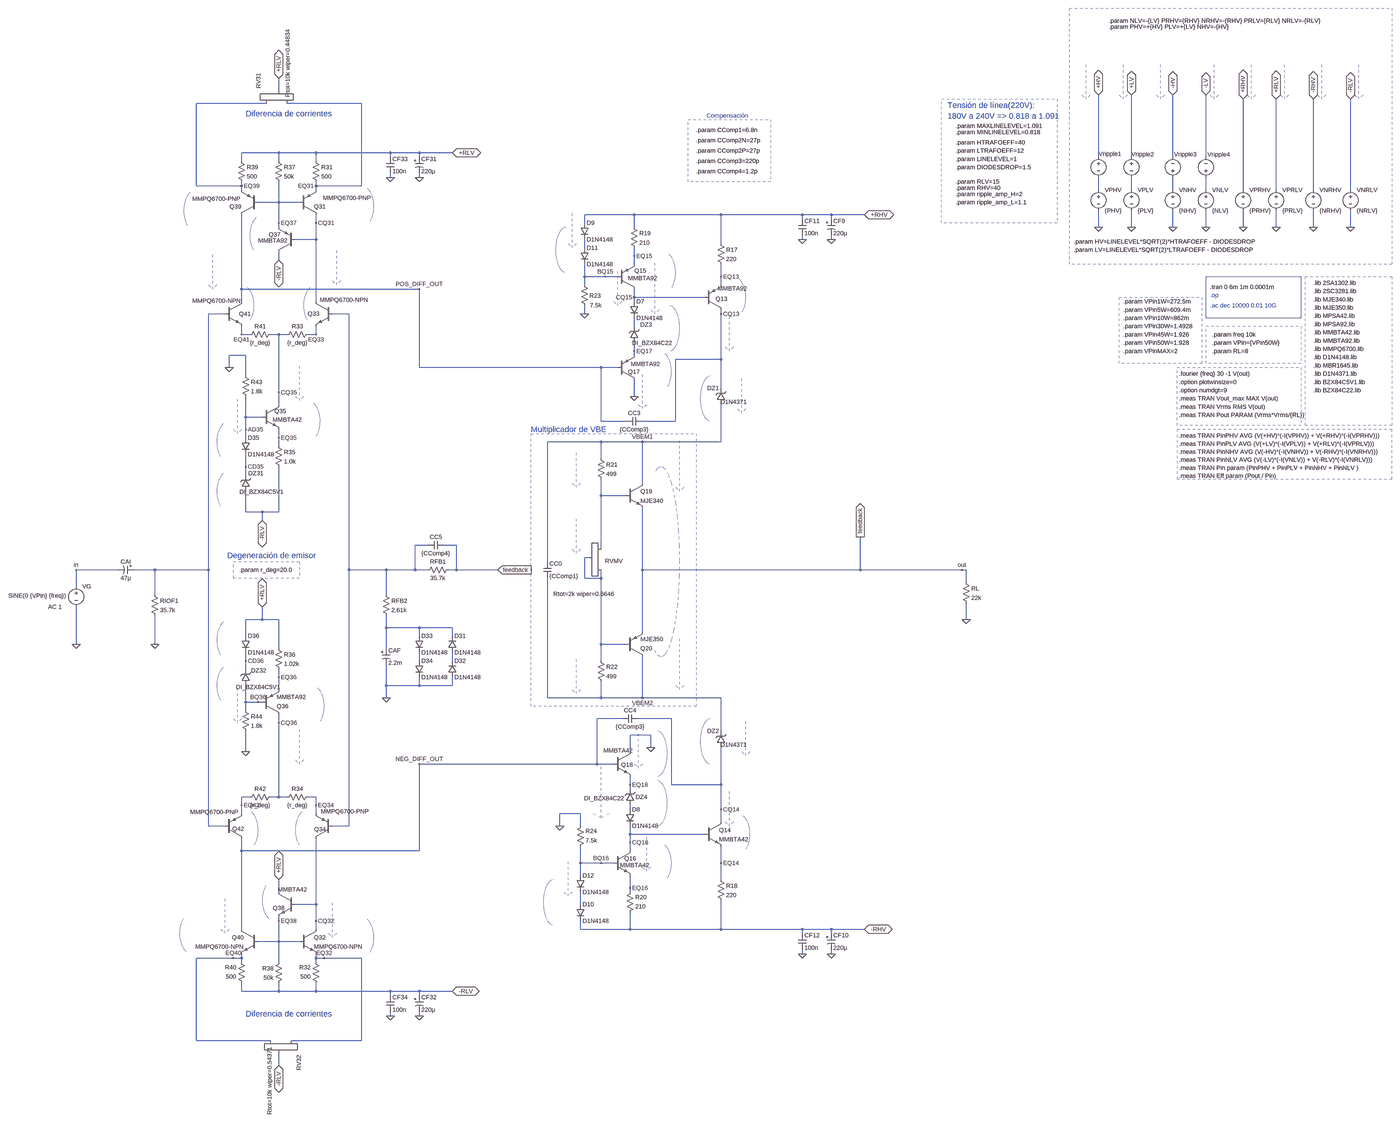
[diagram p0: schematic amplifier_V0.6_SMD_Test.asc, whole sheet]
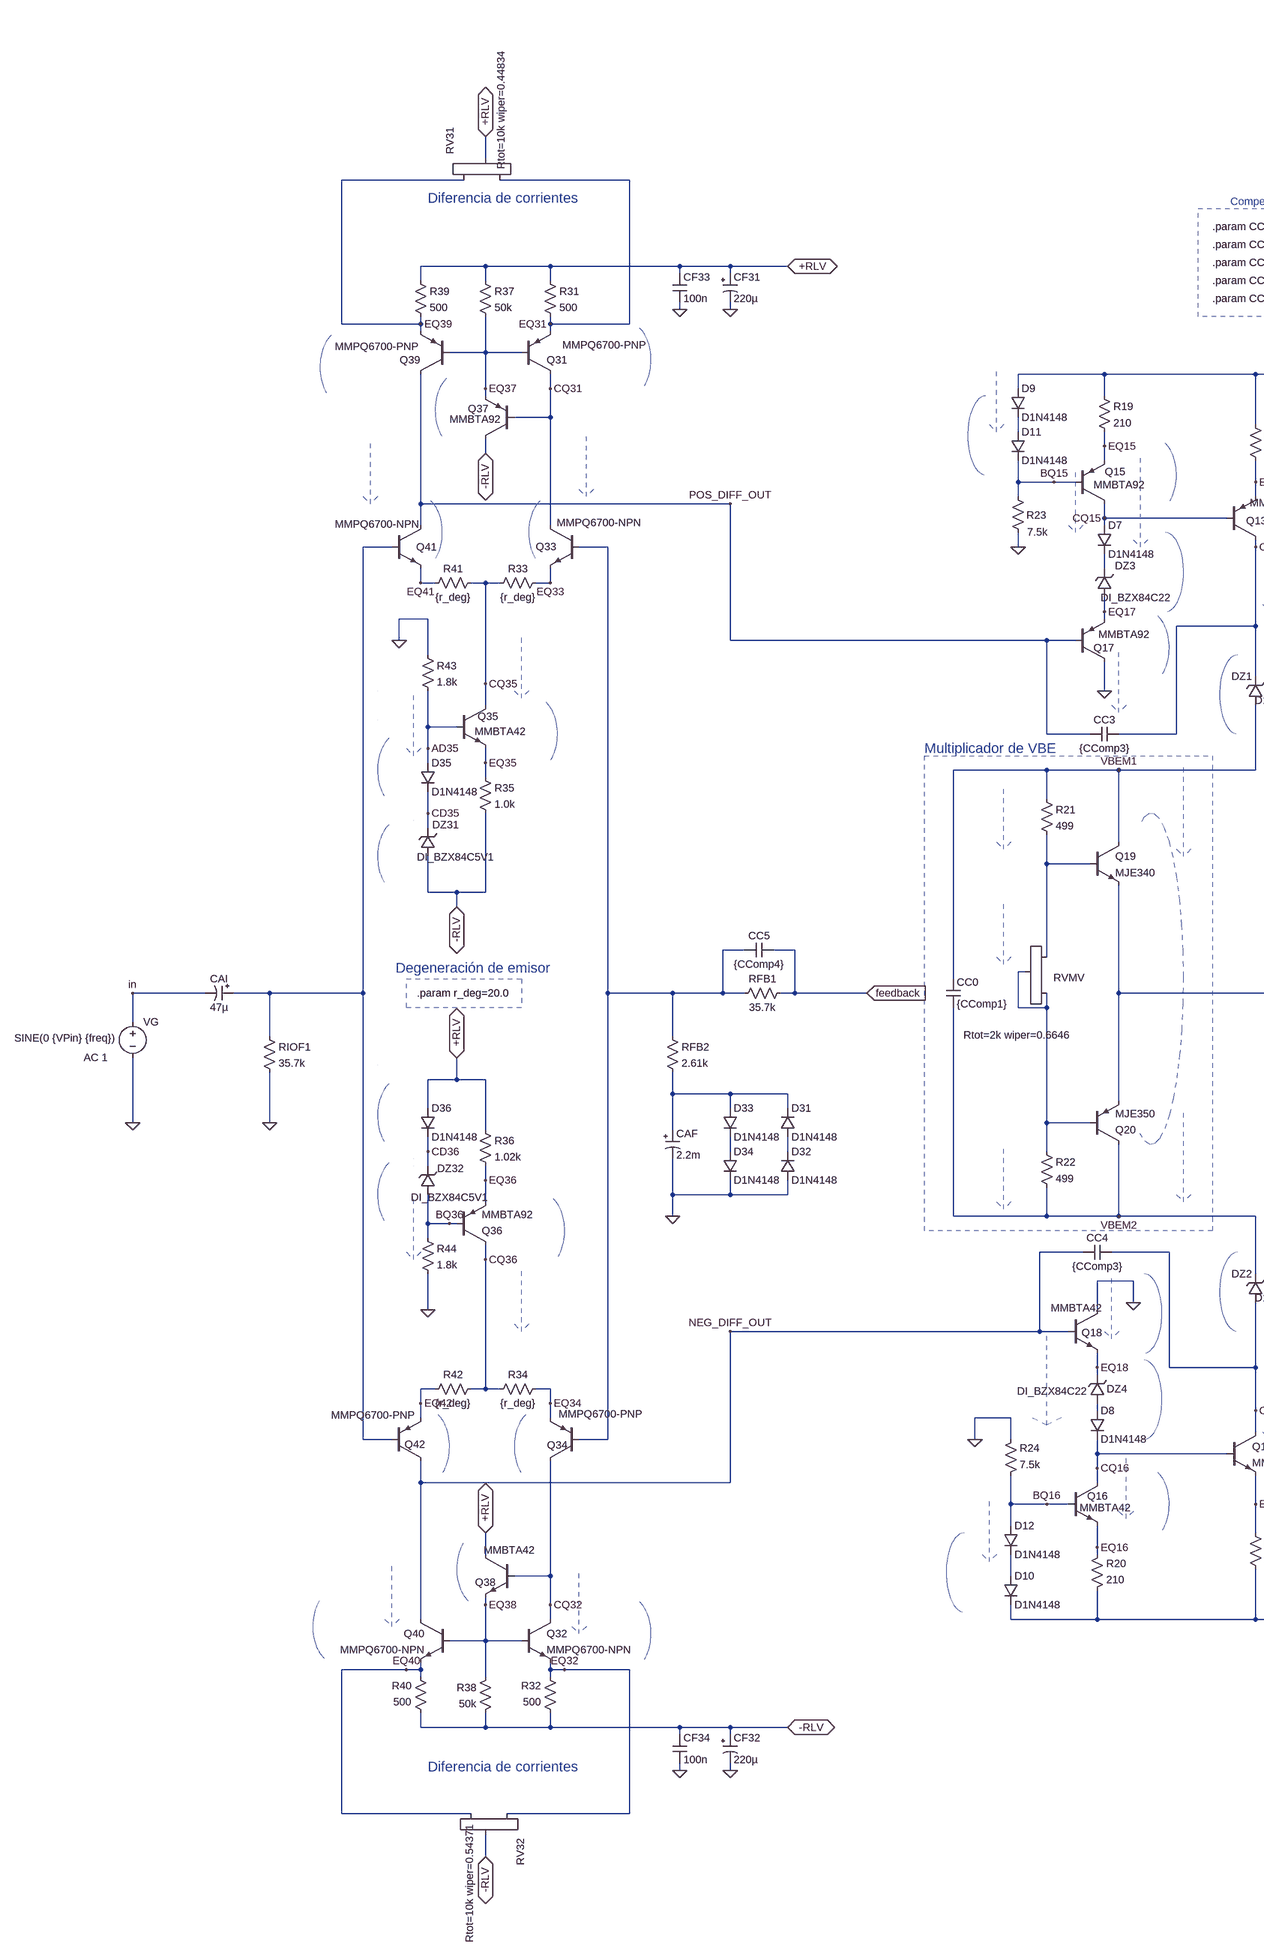
[diagram p1: schematic amplifier_V0.6_SMD_Test.asc, part, row 1 of 1, column 1 of 2]
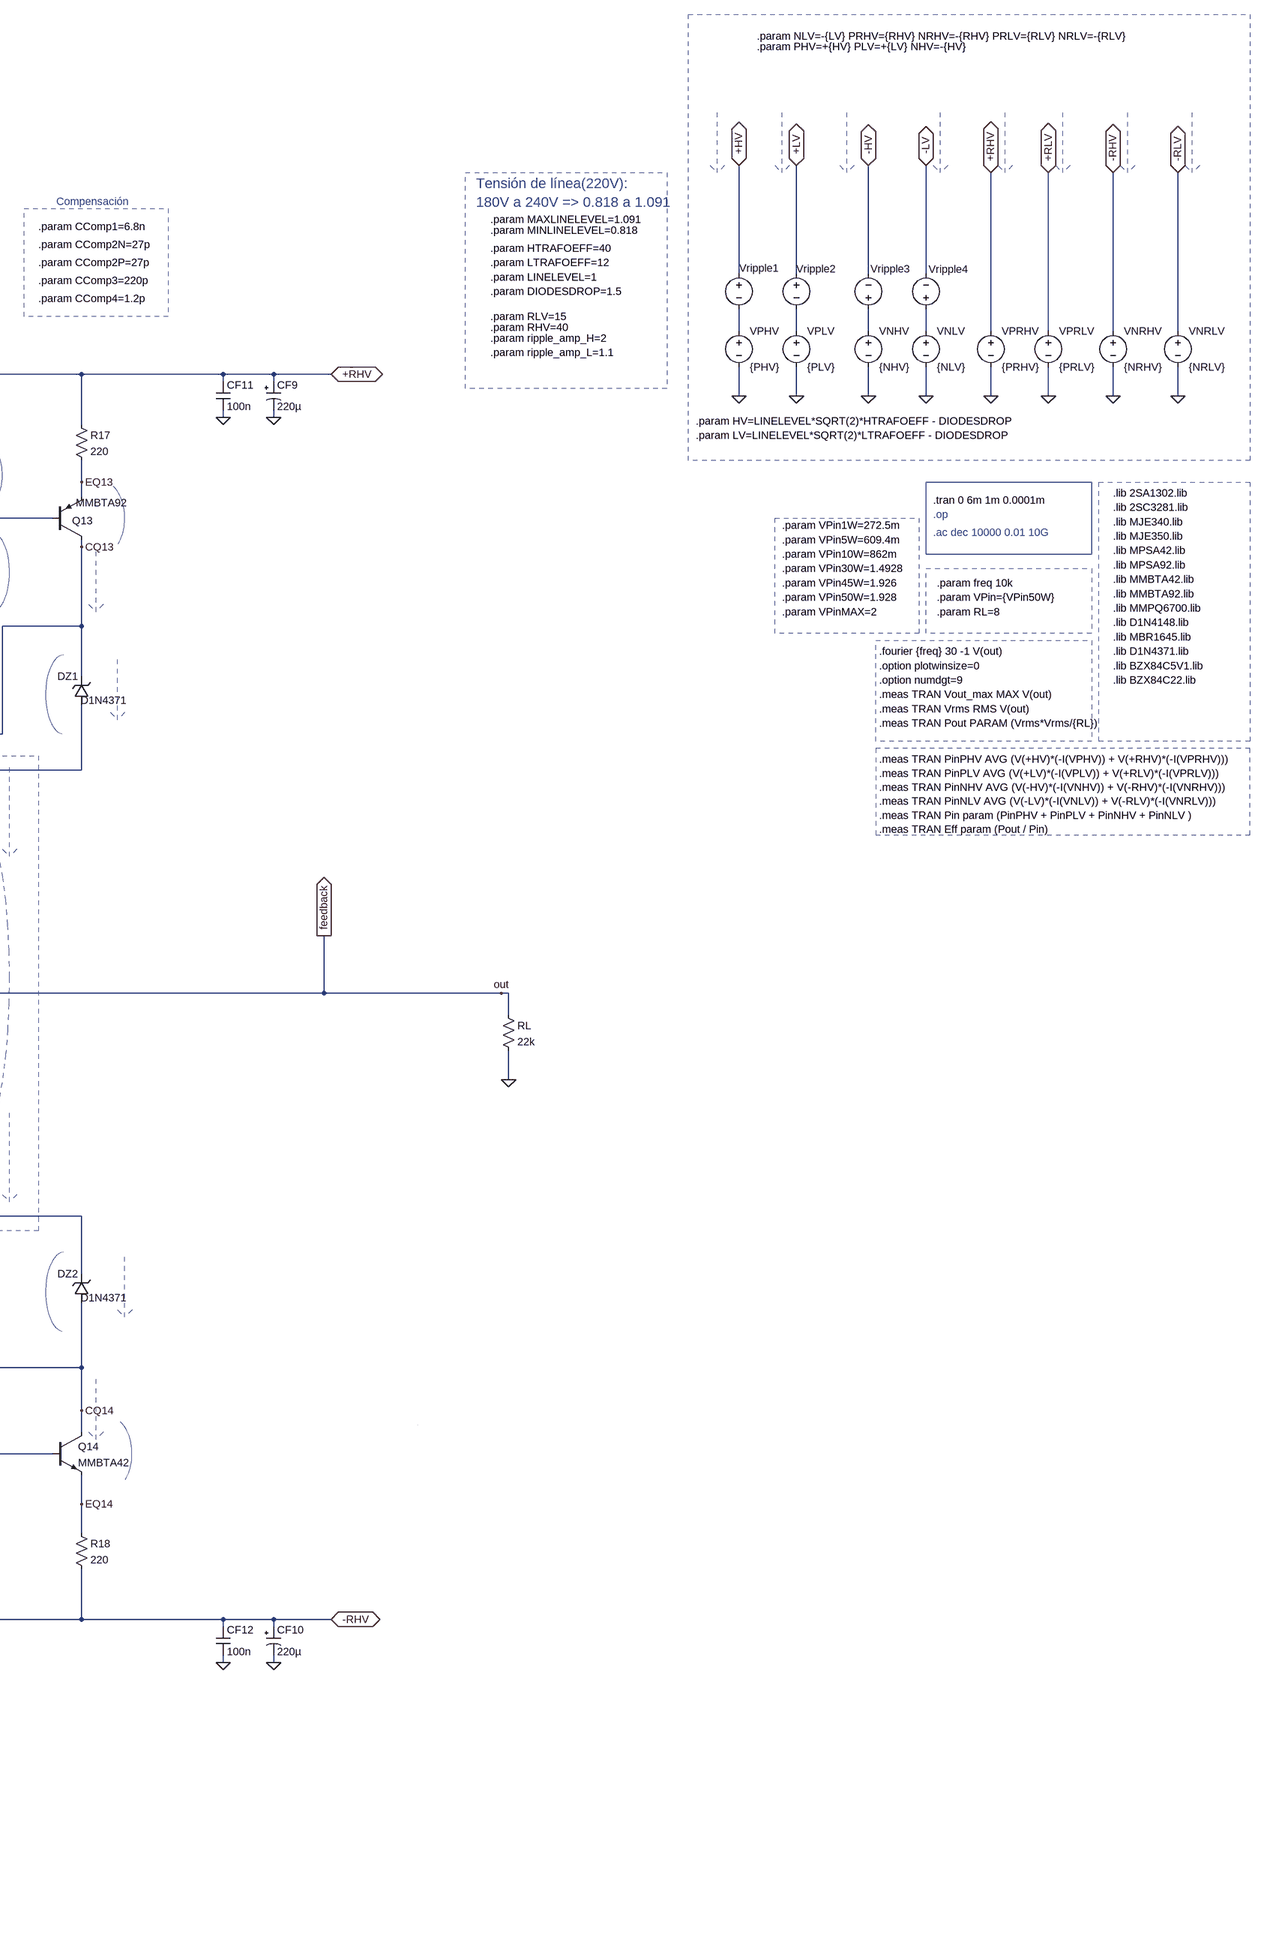
[diagram p2: schematic amplifier_V0.6_SMD_Test.asc, part, row 1 of 1, column 2 of 2]
amplifier_V0.6_SMD_Test.asc, the LTspice schematic file:
Version 4
SHEET 1 4212 2324
WIRE -2016 -1728 -2016 -1776
WIRE -2064 -1680 -2336 -1680
WIRE -1696 -1680 -1984 -1680
WIRE -2016 -1488 -2160 -1488
WIRE -1872 -1488 -2016 -1488
WIRE -1584 -1488 -1872 -1488
WIRE -1472 -1488 -1584 -1488
WIRE -1344 -1488 -1472 -1488
WIRE -1584 -1472 -1584 -1488
WIRE -1472 -1472 -1472 -1488
WIRE 1824 -1472 1824 -1712
WIRE 1952 -1472 1952 -1712
WIRE 2112 -1472 2112 -1712
WIRE 2240 -1472 2240 -1712
WIRE -2160 -1456 -2160 -1488
WIRE -2016 -1456 -2016 -1488
WIRE -1872 -1456 -1872 -1488
WIRE -1584 -1392 -1584 -1408
WIRE -1472 -1392 -1472 -1408
WIRE -2336 -1360 -2336 -1680
WIRE -2160 -1360 -2160 -1376
WIRE -2160 -1360 -2336 -1360
WIRE -1872 -1360 -1872 -1376
WIRE -1696 -1360 -1696 -1680
WIRE -1696 -1360 -1872 -1360
WIRE -2160 -1344 -2160 -1360
WIRE -1872 -1344 -1872 -1360
WIRE 1824 -1344 1824 -1392
WIRE 1952 -1344 1952 -1392
WIRE 2112 -1344 2112 -1392
WIRE 2240 -1344 2240 -1392
WIRE 2384 -1344 2384 -1696
WIRE 2512 -1344 2512 -1696
WIRE 2656 -1344 2656 -1696
WIRE 2800 -1344 2800 -1696
WIRE -2016 -1296 -2016 -1376
WIRE -2016 -1296 -2096 -1296
WIRE -1936 -1296 -2016 -1296
WIRE -640 -1248 -832 -1248
WIRE -304 -1248 -640 -1248
WIRE 176 -1248 -304 -1248
WIRE 288 -1248 176 -1248
WIRE 416 -1248 288 -1248
WIRE 176 -1232 176 -1248
WIRE 288 -1232 288 -1248
WIRE -2016 -1216 -2016 -1296
WIRE -1872 -1216 -1872 -1248
WIRE -832 -1216 -832 -1248
WIRE -2016 -1200 -2016 -1216
WIRE -640 -1200 -640 -1248
WIRE 1824 -1200 1824 -1264
WIRE 1952 -1200 1952 -1264
WIRE 2112 -1200 2112 -1264
WIRE 2240 -1200 2240 -1264
WIRE 2384 -1200 2384 -1264
WIRE 2512 -1200 2512 -1264
WIRE 2656 -1200 2656 -1264
WIRE 2800 -1200 2800 -1264
WIRE -1872 -1152 -1872 -1216
WIRE -1872 -1152 -1952 -1152
WIRE 176 -1152 176 -1168
WIRE 288 -1152 288 -1168
WIRE -304 -1136 -304 -1248
WIRE -832 -1120 -832 -1152
WIRE -640 -1088 -640 -1120
WIRE -2016 -1072 -2016 -1104
WIRE -640 -1056 -640 -1088
WIRE -832 -1008 -832 -1056
WIRE -752 -1008 -832 -1008
WIRE -704 -1008 -752 -1008
WIRE -304 -1008 -304 -1056
WIRE -832 -976 -832 -1008
WIRE -304 -976 -304 -1008
WIRE -2160 -960 -2160 -1248
WIRE -1472 -960 -2160 -960
WIRE -640 -928 -640 -960
WIRE -368 -928 -640 -928
WIRE -2160 -912 -2160 -960
WIRE -1872 -912 -1872 -1152
WIRE -640 -912 -640 -928
WIRE -2224 -864 -2288 -864
WIRE -1744 -864 -1808 -864
WIRE -832 -864 -832 -896
WIRE -304 -864 -304 -880
WIRE -640 -816 -640 -848
WIRE -2160 -784 -2160 -816
WIRE -2128 -784 -2160 -784
WIRE -2016 -784 -2048 -784
WIRE -1984 -784 -2016 -784
WIRE -1872 -784 -1872 -816
WIRE -1872 -784 -1904 -784
WIRE -640 -720 -640 -752
WIRE -2144 -704 -2208 -704
WIRE -640 -704 -640 -720
WIRE -304 -688 -304 -864
WIRE -304 -688 -480 -688
WIRE -2208 -656 -2208 -704
WIRE -1472 -656 -1472 -960
WIRE -768 -656 -1472 -656
WIRE -704 -656 -768 -656
WIRE -2144 -624 -2144 -704
WIRE -304 -576 -304 -688
WIRE -2016 -560 -2016 -784
WIRE -640 -544 -640 -608
WIRE -2016 -512 -2016 -560
WIRE -2144 -464 -2144 -544
WIRE -2080 -464 -2144 -464
WIRE -768 -448 -768 -656
WIRE -672 -448 -768 -448
WIRE -480 -448 -480 -688
WIRE -480 -448 -608 -448
WIRE -2144 -416 -2144 -464
WIRE -2144 -384 -2144 -416
WIRE -2016 -384 -2016 -416
WIRE -768 -368 -976 -368
WIRE -608 -368 -768 -368
WIRE -304 -368 -304 -512
WIRE -304 -368 -608 -368
WIRE -2016 -352 -2016 -384
WIRE -768 -304 -768 -368
WIRE -2144 -272 -2144 -320
WIRE -2144 -240 -2144 -272
WIRE -608 -208 -608 -368
WIRE -768 -160 -768 -224
WIRE -672 -160 -768 -160
WIRE -2144 -96 -2144 -176
WIRE -2080 -96 -2144 -96
WIRE -2016 -96 -2016 -272
WIRE -2016 -96 -2080 -96
WIRE -2080 -64 -2080 -96
WIRE -1440 32 -1488 32
WIRE -1328 32 -1376 32
WIRE -768 48 -768 -160
WIRE -816 80 -832 80
WIRE -976 96 -976 -368
WIRE -2640 128 -2912 128
WIRE -2496 128 -2576 128
WIRE -2288 128 -2288 -864
WIRE -2288 128 -2496 128
WIRE -1744 128 -1744 -864
WIRE -1600 128 -1744 128
WIRE -1488 128 -1488 32
WIRE -1488 128 -1600 128
WIRE -1440 128 -1488 128
WIRE -1328 128 -1328 32
WIRE -1328 128 -1360 128
WIRE -1168 128 -1328 128
WIRE -608 128 -608 -112
WIRE 400 128 400 0
WIRE 400 128 -608 128
WIRE 1296 128 400 128
WIRE 1312 128 1296 128
WIRE -832 160 -832 80
WIRE -768 160 -768 128
WIRE -768 160 -832 160
WIRE 1312 176 1312 128
WIRE -2912 192 -2912 128
WIRE -2496 224 -2496 128
WIRE -1600 224 -1600 128
WIRE -2080 320 -2080 272
WIRE -2080 320 -2144 320
WIRE -2016 320 -2080 320
WIRE 1312 320 1312 256
WIRE -1600 352 -1600 304
WIRE -1472 352 -1600 352
WIRE -1344 352 -1472 352
WIRE -608 368 -608 128
WIRE -2144 384 -2144 320
WIRE -1472 384 -1472 352
WIRE -1344 384 -1344 352
WIRE -2912 416 -2912 272
WIRE -2496 416 -2496 304
WIRE -768 416 -768 160
WIRE -672 416 -768 416
WIRE -2016 432 -2016 320
WIRE -1600 432 -1600 352
WIRE -2144 480 -2144 448
WIRE -1472 480 -1472 448
WIRE -1344 480 -1344 448
WIRE -768 480 -768 416
WIRE -2144 512 -2144 480
WIRE -2016 544 -2016 512
WIRE -1600 576 -1600 496
WIRE -1472 576 -1472 544
WIRE -1472 576 -1600 576
WIRE -1344 576 -1344 544
WIRE -1344 576 -1472 576
WIRE -2016 592 -2016 544
WIRE -1600 624 -1600 576
WIRE -976 624 -976 160
WIRE -768 624 -768 560
WIRE -768 624 -976 624
WIRE -608 624 -608 464
WIRE -608 624 -768 624
WIRE -304 624 -608 624
WIRE -2144 640 -2144 576
WIRE -2096 640 -2144 640
WIRE -2080 640 -2096 640
WIRE -2144 672 -2144 640
WIRE -688 704 -784 704
WIRE -496 704 -624 704
WIRE -2016 720 -2016 688
WIRE -304 752 -304 624
WIRE -576 768 -656 768
WIRE -576 816 -576 768
WIRE -2144 832 -2144 752
WIRE -656 832 -656 768
WIRE -784 880 -784 704
WIRE -784 880 -1472 880
WIRE -720 880 -784 880
WIRE -656 960 -656 928
WIRE -496 960 -496 704
WIRE -304 960 -304 816
WIRE -304 960 -496 960
WIRE -656 976 -656 960
WIRE -2128 1008 -2160 1008
WIRE -2016 1008 -2016 720
WIRE -2016 1008 -2048 1008
WIRE -1984 1008 -2016 1008
WIRE -1872 1008 -1904 1008
WIRE -2160 1040 -2160 1008
WIRE -1872 1040 -1872 1008
WIRE -656 1056 -656 1040
WIRE -304 1056 -304 960
WIRE -2160 1072 -2160 1040
WIRE -1872 1072 -1872 1040
WIRE -848 1072 -928 1072
WIRE -304 1104 -304 1056
WIRE -2288 1120 -2288 128
WIRE -2224 1120 -2288 1120
WIRE -1744 1120 -1744 128
WIRE -1744 1120 -1808 1120
WIRE -928 1120 -928 1072
WIRE -848 1120 -848 1072
WIRE -656 1152 -656 1120
WIRE -368 1152 -656 1152
WIRE -656 1184 -656 1152
WIRE -2160 1216 -2160 1168
WIRE -1472 1216 -1472 880
WIRE -1472 1216 -2160 1216
WIRE -656 1216 -656 1184
WIRE -848 1264 -848 1200
WIRE -768 1264 -848 1264
WIRE -720 1264 -768 1264
WIRE -304 1264 -304 1200
WIRE -848 1312 -848 1264
WIRE -304 1328 -304 1264
WIRE -656 1360 -656 1312
WIRE -2016 1376 -2016 1328
WIRE -656 1376 -656 1360
WIRE -1872 1424 -1872 1168
WIRE -1872 1424 -1952 1424
WIRE -848 1424 -848 1376
WIRE -2016 1488 -2016 1472
WIRE -1872 1488 -1872 1424
WIRE -2160 1520 -2160 1216
WIRE -1872 1520 -1872 1488
WIRE -848 1520 -848 1488
WIRE -656 1520 -656 1456
WIRE -656 1520 -848 1520
WIRE -304 1520 -304 1408
WIRE -304 1520 -656 1520
WIRE 176 1520 -304 1520
WIRE 288 1520 176 1520
WIRE 416 1520 288 1520
WIRE 176 1536 176 1520
WIRE 288 1536 288 1520
WIRE -2016 1568 -2016 1488
WIRE -2016 1568 -2096 1568
WIRE -1936 1568 -2016 1568
WIRE 176 1616 176 1600
WIRE 288 1616 288 1600
WIRE -2192 1632 -2336 1632
WIRE -2160 1632 -2160 1616
WIRE -2160 1632 -2192 1632
WIRE -1872 1632 -1872 1616
WIRE -1840 1632 -1872 1632
WIRE -1696 1632 -1840 1632
WIRE -2160 1648 -2160 1632
WIRE -2016 1648 -2016 1568
WIRE -1872 1648 -1872 1632
WIRE -2160 1760 -2160 1728
WIRE -2016 1760 -2016 1728
WIRE -2016 1760 -2160 1760
WIRE -1872 1760 -1872 1728
WIRE -1872 1760 -2016 1760
WIRE -1584 1760 -1872 1760
WIRE -1472 1760 -1584 1760
WIRE -1344 1760 -1472 1760
WIRE -1584 1776 -1584 1760
WIRE -1472 1776 -1472 1760
WIRE -1584 1856 -1584 1840
WIRE -1472 1856 -1472 1840
WIRE -2336 1952 -2336 1632
WIRE -2048 1952 -2336 1952
WIRE -1696 1952 -1696 1632
WIRE -1696 1952 -1968 1952
WIRE -2016 2048 -2016 2000
FLAG -608 -368 VBEM1
FLAG -608 624 VBEM2
FLAG -2496 416 0
FLAG -1600 624 0
FLAG -1344 -1488 +RLV
IOPIN -1344 -1488 BiDir
FLAG -1344 1760 -RLV
IOPIN -1344 1760 BiDir
FLAG -2080 -64 -RLV
IOPIN -2080 -64 BiDir
FLAG -2080 272 +RLV
IOPIN -2080 272 BiDir
FLAG 1312 320 0
FLAG 1296 128 out
FLAG -1168 128 feedback
IOPIN -1168 128 In
FLAG -2912 416 0
FLAG -2912 128 in
FLAG -2016 -1776 +RLV
IOPIN -2016 -1776 BiDir
FLAG -2016 2048 -RLV
IOPIN -2016 2048 BiDir
FLAG 416 -1248 +RHV
IOPIN 416 -1248 BiDir
FLAG 416 1520 -RHV
IOPIN 416 1520 BiDir
FLAG -832 -864 0
FLAG -640 -544 0
FLAG -576 816 0
FLAG -928 1120 0
FLAG -2144 832 0
FLAG -2208 -656 0
FLAG -1472 -960 POS_DIFF_OUT
FLAG -1472 880 NEG_DIFF_OUT
FLAG 288 -1152 0
FLAG 176 -1152 0
FLAG 288 1616 0
FLAG 176 1616 0
FLAG -1472 -1392 0
FLAG -1584 -1392 0
FLAG -1472 1856 0
FLAG -1584 1856 0
FLAG 1824 -1200 0
FLAG 1952 -1200 0
FLAG 2112 -1200 0
FLAG 2240 -1200 0
FLAG 1824 -1712 +HV
IOPIN 1824 -1712 BiDir
FLAG 1952 -1712 +LV
IOPIN 1952 -1712 BiDir
FLAG 2112 -1712 -HV
IOPIN 2112 -1712 BiDir
FLAG 2240 -1712 -LV
IOPIN 2240 -1712 BiDir
FLAG 2384 -1200 0
FLAG 2656 -1200 0
FLAG 2384 -1696 +RHV
IOPIN 2384 -1696 BiDir
FLAG 2656 -1696 -RHV
IOPIN 2656 -1696 BiDir
FLAG 2512 -1200 0
FLAG 2512 -1696 +RLV
IOPIN 2512 -1696 BiDir
FLAG 2800 -1200 0
FLAG 2800 -1696 -RLV
IOPIN 2800 -1696 BiDir
FLAG -1872 -1360 EQ31
FLAG -1872 -1216 CQ31
FLAG -2160 -1360 EQ39
FLAG -2160 -784 EQ41
FLAG -1872 -784 EQ33
FLAG -2016 -560 CQ35
FLAG -2016 -384 EQ35
FLAG -2016 720 CQ36
FLAG -2016 544 EQ36
FLAG -2016 -1216 EQ37
FLAG -2016 1328 +RLV
IOPIN -2016 1328 BiDir
FLAG -2016 -1072 -RLV
IOPIN -2016 -1072 BiDir
FLAG -2144 -272 CD35
FLAG -2144 -416 AD35
FLAG -2144 480 CD36
FLAG -2096 640 BQ36
FLAG -1840 1632 EQ32
FLAG -2192 1632 EQ40
FLAG -1872 1488 CQ32
FLAG -2160 1040 EQ42
FLAG -1872 1040 EQ34
FLAG -2016 1488 EQ38
FLAG -656 1360 EQ16
FLAG -656 1184 CQ16
FLAG -768 1264 BQ16
FLAG -304 1264 EQ14
FLAG -656 960 EQ18
FLAG -304 1056 CQ14
FLAG -640 -720 EQ17
FLAG -640 -928 CQ15
FLAG -640 -1088 EQ15
FLAG -752 -1008 BQ15
FLAG -304 -864 CQ13
FLAG -304 -1008 EQ13
FLAG 400 0 feedback
IOPIN 400 0 Out
DATAFLAG -464 96 "V(vbem1)-V(vbem2)"
DATAFLAG -384 -496 "V(CQ13)-V(vbem1)"
DATAFLAG -464 624 ""
DATAFLAG -464 -368 ""
DATAFLAG -560 1136 ""
DATAFLAG -944 -656 ""
DATAFLAG -1008 880 ""
DATAFLAG -416 -688 ""
DATAFLAG -2016 -688 ""
DATAFLAG -2016 896 ""
DATAFLAG -2160 1328 ""
DATAFLAG -1872 1344 ""
DATAFLAG -2160 -1040 ""
DATAFLAG -1872 -1040 ""
DATAFLAG -2016 -1312 ""
DATAFLAG 1200 128 ""
DATAFLAG -1632 128 ""
DATAFLAG -464 -784 "V(CQ15)-V(EQ17)"
DATAFLAG -368 960 ""
DATAFLAG -768 976 "-Ie(Q16)"
DATAFLAG -608 80 ""
DATAFLAG -560 -960 "-Ic(Q15)"
DATAFLAG -1248 128 ""
DATAFLAG 384 -1248 ""
DATAFLAG -2016 -1088 ""
DATAFLAG -2096 -96 ""
DATAFLAG -2032 320 ""
DATAFLAG -1968 1760 ""
DATAFLAG -2016 1344 ""
DATAFLAG -704 -944 "I(D7)"
DATAFLAG -512 1056 "V(EQ18)-V(CQ16)"
DATAFLAG -384 832 "V(vbem2)-V(CQ14)"
DATAFLAG -2016 1584 ""
DATAFLAG -832 -1248 ""
DATAFLAG -848 1520 ""
DATAFLAG -2416 128 ""
DATAFLAG -1744 1632 ""
DATAFLAG -2288 1632 ""
DATAFLAG 384 1520 ""
DATAFLAG -1376 -1488 ""
DATAFLAG -1376 1760 ""
DATAFLAG -880 -1216 "I(D9)"
DATAFLAG -272 -800 "-Ic(Q13)"
DATAFLAG -464 -272 "Ic(Q19)"
DATAFLAG -464 496 "-Ic(Q20)"
DATAFLAG -768 -160 ""
DATAFLAG -768 416 ""
DATAFLAG -608 -592 "-Ic(Q17)"
DATAFLAG -624 800 "Ic(Q18)"
DATAFLAG -592 1200 "Ic(Q16)"
DATAFLAG -896 1296 "I(D10)"
DATAFLAG -1792 -1072 "Ic(Q33)"
DATAFLAG -2272 -1056 "Ic(Q41)"
DATAFLAG -2176 -496 "I(D35)"
DATAFLAG -2176 624 "I(D36)"
DATAFLAG -1936 -624 "Ic(Q35)"
DATAFLAG -1936 784 "-Ic(Q36)"
DATAFLAG -1808 1456 "Ic(Q32)"
DATAFLAG -2224 1440 "Ic(Q40)"
DATAFLAG -272 1024 "Ic(Q14)"
DATAFLAG 1776 -1792 "-I(Vmeas1)"
DATAFLAG 2384 -1792 "-I(Vmeas5)"
DATAFLAG 1920 -1824 "-I(Vmeas2)"
DATAFLAG 2064 -1792 "-I(Vmeas3)"
DATAFLAG 2832 -1824 "-I(Vmeas8)"
DATAFLAG 2688 -1792 "-I(Vmeas7)"
DATAFLAG 2544 -1824 "-I(Vmeas6)"
DATAFLAG 2272 -1824 "-I(Vmeas4)"
DATAFLAG -1648 -1280 "V(EQ31)-V(CQ31)"
DATAFLAG -2384 -1264 "V(EQ39)-V(POS_DIFF_OUT)"
DATAFLAG -2112 -896 "V(POS_DIFF_OUT)-V(EQ41)"
DATAFLAG -1920 -896 "V(CQ31)-V(EQ33)"
DATAFLAG -1856 -448 "V(CQ35)-V(EQ35)"
DATAFLAG -1840 656 "V(EQ36)-V(CQ36)"
DATAFLAG -2128 -1168 "V(EQ37)-V(-rlv)"
DATAFLAG -2256 -176 "V(CD35)-V(-rlv)"
DATAFLAG -2256 -368 "V(AD35)-V(CD35)"
DATAFLAG -2256 400 "V(+rlv)-V(CD36)"
DATAFLAG -2256 576 "V(CD36)-V(BQ36)"
DATAFLAG -1648 1552 "V(CQ32)-V(EQ32)"
DATAFLAG -2400 1536 "V(NEG_DIFF_OUT)-V(EQ40)"
DATAFLAG -2080 1408 "V(+rlv)-V(EQ38)"
DATAFLAG -2096 1136 "V(EQ42)-V(NEG_DIFF_OUT)"
DATAFLAG -1952 1136 "V(EQ34)-V(CQ32)"
DATAFLAG -496 1264 "V(CQ16)-V(EQ16)"
DATAFLAG -992 1456 "V(BQ16)-V(-rhv)"
DATAFLAG -208 752 "-I(Dz2)"
DATAFLAG -192 1152 "V(CQ14)-V(EQ14)"
DATAFLAG -512 880 "-V(EQ18)"
DATAFLAG -224 -576 "-I(Dz1)"
DATAFLAG -944 -1072 "V(+rhv)-V(BQ15)"
DATAFLAG -480 -1024 "V(EQ15)-V(CQ15)"
DATAFLAG -496 -640 "V(EQ17)"
DATAFLAG -208 -928 "V(EQ13)-V(CQ13)"
DATAFLAG -864 -32 "Ix(RVMV:B)"
DATAFLAG -864 -288 "I(R21)"
DATAFLAG -864 512 "I(R22)"
DATAFLAG -2016 1888 "Ic(Q40)-Ic(Q32)"
DATAFLAG -2016 -1600 "Ic(Q41)-Ic(Q33)"
DATAFLAG -2304 -1360 ""
DATAFLAG -1776 -1360 ""
DATAFLAG -2672 1936 "V(out)"
DATAFLAG -2448 -1776 "V(out)"
SYMBOL pnp -672 464 M180
SYMATTR InstName Q20
SYMATTR Value MJE350
SYMBOL npn -672 -208 R0
SYMATTR InstName Q19
SYMATTR Value MJE340
SYMBOL res -784 -320 R0
SYMATTR InstName R21
SYMATTR Value 499
SYMBOL res -784 464 R0
SYMATTR InstName R22
SYMATTR Value 499
SYMBOL pnp -368 -880 M180
WINDOW 0 43 42 Left 2
WINDOW 3 51 82 Left 2
SYMATTR InstName Q13
SYMATTR Value MMBTA92
SYMBOL npn -368 1104 R0
SYMATTR InstName Q14
SYMATTR Value MMBTA42
SYMBOL npn -720 832 R0
WINDOW 0 29 51 Left 2
WINDOW 3 -39 -4 Left 2
SYMATTR InstName Q18
SYMATTR Value MMBTA42
SYMBOL res -1616 208 R0
SYMATTR InstName RFB2
SYMATTR Value 2.61k
SYMBOL res -1344 112 R90
WINDOW 0 0 56 VBottom 2
WINDOW 3 32 56 VTop 2
SYMATTR InstName RFB1
SYMATTR Value 35.7k
SYMBOL res -2512 208 R0
SYMATTR InstName RIOF1
SYMATTR Value 35.7k
SYMBOL pnp -704 -608 M180
WINDOW 0 40 32 Left 2
WINDOW 3 51 62 Left 2
SYMATTR InstName Q17
SYMATTR Value MMBTA92
SYMBOL npn -2224 -912 R0
WINDOW 3 -127 -3 Left 2
WINDOW 0 54 48 Left 2
SYMATTR Value MMPQ6700-NPN
SYMATTR InstName Q41
SYMBOL npn -1808 -912 M0
WINDOW 0 50 47 Left 2
WINDOW 3 -138 -6 Left 2
SYMATTR InstName Q33
SYMATTR Value MMPQ6700-NPN
SYMBOL pnp -2224 1168 M180
WINDOW 3 -135 102 Left 2
WINDOW 0 28 37 Left 2
SYMATTR Value MMPQ6700-PNP
SYMATTR InstName Q42
SYMBOL pnp -1808 1168 R180
WINDOW 0 25 35 Left 2
WINDOW 3 -141 104 Left 2
SYMATTR InstName Q34
SYMATTR Value MMPQ6700-PNP
SYMBOL cap -608 -464 R90
WINDOW 0 0 32 VBottom 2
WINDOW 3 32 32 VTop 2
SYMATTR InstName CC3
SYMATTR Value {CComp3}
SYMBOL cap -624 688 R90
WINDOW 0 0 32 VBottom 2
WINDOW 3 32 32 VTop 2
SYMATTR InstName CC4
SYMATTR Value {CComp3}
SYMBOL pnp -1936 -1248 M180
WINDOW 3 91 65 Left 2
SYMATTR Value MMPQ6700-PNP
SYMATTR InstName Q31
SYMBOL pnp -2096 -1248 R180
WINDOW 0 65 32 Left 2
WINDOW 3 69 62 Left 2
SYMATTR InstName Q39
SYMATTR Value MMPQ6700-PNP
SYMBOL npn -2096 1520 M0
SYMATTR InstName Q40
SYMATTR Value MMPQ6700-NPN
SYMBOL npn -1936 1520 R0
SYMATTR InstName Q32
SYMATTR Value MMPQ6700-NPN
SYMBOL res -320 -1152 R0
SYMATTR InstName R17
SYMATTR Value 220
SYMBOL res -320 1312 R0
SYMATTR InstName R18
SYMATTR Value 220
SYMBOL res -2176 -1472 R0
SYMATTR InstName R39
SYMATTR Value 500
SYMBOL res -1888 -1472 R0
SYMATTR InstName R31
SYMATTR Value 500
SYMBOL res -1856 1744 R180
WINDOW 0 36 76 Left 2
WINDOW 3 36 40 Left 2
SYMATTR InstName R32
SYMATTR Value 500
SYMBOL res -2144 1744 R180
WINDOW 0 36 76 Left 2
WINDOW 3 36 40 Left 2
SYMATTR InstName R40
SYMATTR Value 500
SYMBOL npn -1952 1376 M0
WINDOW 0 41 62 Left 2
WINDOW 3 -46 -10 Left 2
SYMATTR InstName Q38
SYMATTR Value MMBTA42
SYMBOL pnp -1952 -1104 R180
WINDOW 0 57 67 Left 2
WINDOW 3 30 44 Left 2
SYMATTR InstName Q37
SYMATTR Value MMBTA92
SYMBOL res -2000 1632 M0
SYMATTR InstName R38
SYMATTR Value 50k
SYMBOL res -2032 -1472 R0
SYMATTR InstName R37
SYMATTR Value 50k
SYMBOL res -2160 -640 R0
SYMATTR InstName R43
SYMATTR Value 1.8k
SYMBOL npn -2080 -512 R0
WINDOW 0 47 25 Left 2
WINDOW 3 40 58 Left 2
SYMATTR InstName Q35
SYMATTR Value MMBTA42
SYMBOL res -2032 -368 R0
SYMATTR InstName R35
SYMATTR Value 1.0k
SYMBOL pnp -2080 688 M180
SYMATTR InstName Q36
SYMATTR Value MMBTA92
SYMBOL res -2032 416 R0
SYMATTR InstName R36
SYMATTR Value 1.02k
SYMBOL res -2160 656 R0
SYMATTR InstName R44
SYMATTR Value 1.8k
SYMBOL res 1296 160 R0
SYMATTR InstName RL
SYMATTR Value 22k
SYMBOL voltage -2912 176 R0
WINDOW 3 -263 52 Left 2
WINDOW 123 -109 95 Left 2
WINDOW 39 0 0 Left 2
SYMATTR Value SINE(0 {VPin} {freq})
SYMATTR Value2 AC 1
SYMATTR InstName VG
SYMBOL zener -2128 -176 R180
WINDOW 0 -53 70 Left 2
WINDOW 3 -131 -1 Left 2
SYMATTR InstName DZ31
SYMATTR Value DI_BZX84C5V1
SYMATTR Prefix X
SYMBOL zener -2128 576 R180
WINDOW 0 -64 58 Left 2
WINDOW 3 -117 -6 Left 2
SYMATTR InstName DZ32
SYMATTR Value DI_BZX84C5V1
SYMATTR Prefix X
SYMBOL potentiometer_standard -1952 1936 R90
WINDOW 3 39 99 Left 2
SYMATTR Value Rtot=10k wiper=0.54371
SYMATTR InstName RV32
SYMATTR SpiceLine ""
SYMBOL potentiometer_standard -2080 -1664 R270
WINDOW 3 39 99 Left 2
SYMATTR Value Rtot=10k wiper=0.44834
SYMATTR InstName RV31
SYMATTR SpiceLine ""
SYMBOL cap -1376 16 R90
WINDOW 0 0 32 VBottom 2
WINDOW 3 32 32 VTop 2
SYMATTR InstName CC5
SYMATTR Value {CComp4}
SYMBOL pnp -704 -960 M180
WINDOW 0 65 71 Left 2
WINDOW 3 40 42 Left 2
SYMATTR InstName Q15
SYMATTR Value MMBTA92
SYMBOL res -656 -1216 R0
SYMATTR InstName R19
SYMATTR Value 210
SYMBOL res -848 -992 R0
WINDOW 0 35 57 Left 2
WINDOW 3 36 95 Left 2
SYMATTR InstName R23
SYMATTR Value 7.5k
SYMBOL res -672 1472 M180
WINDOW 0 36 76 Left 2
WINDOW 3 36 40 Left 2
SYMATTR InstName R20
SYMATTR Value 210
SYMBOL res -864 1216 M180
WINDOW 0 36 76 Left 2
WINDOW 3 36 40 Left 2
SYMATTR InstName R24
SYMATTR Value 7.5k
SYMBOL npn -720 1216 R0
WINDOW 0 42 30 Left 2
WINDOW 3 25 56 Left 2
SYMATTR InstName Q16
SYMATTR Value MMBTA42
SYMBOL diode -864 1312 R0
SYMATTR InstName D12
SYMATTR Value D1N4148
SYMBOL diode -864 1424 R0
SYMATTR InstName D10
SYMATTR Value D1N4148
SYMBOL diode -848 -1216 R0
SYMATTR InstName D9
SYMATTR Value D1N4148
SYMBOL diode -848 -1120 R0
SYMATTR InstName D11
SYMATTR Value D1N4148
SYMBOL diode -656 -912 R0
SYMATTR InstName D7
SYMATTR Value D1N4148
SYMBOL diode -672 1056 R0
SYMATTR InstName D8
SYMATTR Value D1N4148
SYMBOL potentiometer_standard -752 144 R180
WINDOW 3 -36 -77 Left 2
WINDOW 0 -68 50 Left 2
WINDOW 38 50 -51 Left 2
SYMATTR Value Rtot=2k wiper=0.6646
SYMATTR InstName RVMV
SYMATTR SpiceLine ""
SYMBOL diode -2160 384 R0
SYMATTR InstName D36
SYMATTR Value D1N4148
SYMBOL diode -2160 -384 R0
SYMATTR InstName D35
SYMATTR Value D1N4148
SYMBOL res -2032 -800 R90
WINDOW 0 0 56 VBottom 2
WINDOW 3 32 56 VTop 2
SYMATTR InstName R41
SYMATTR Value {r_deg}
SYMBOL res -1888 -800 R90
WINDOW 0 0 56 VBottom 2
WINDOW 3 32 56 VTop 2
SYMATTR InstName R33
SYMATTR Value {r_deg}
SYMBOL res -2032 992 R90
WINDOW 0 0 56 VBottom 2
WINDOW 3 32 56 VTop 2
SYMATTR InstName R42
SYMATTR Value {r_deg}
SYMBOL res -1888 992 R90
WINDOW 0 0 56 VBottom 2
WINDOW 3 32 56 VTop 2
SYMATTR InstName R34
SYMATTR Value {r_deg}
SYMBOL cap 160 -1232 R0
SYMATTR InstName CF11
SYMATTR Value 100n
SYMBOL polcap 272 -1232 R0
SYMATTR InstName CF9
SYMATTR Value 220µ
SYMBOL cap 160 1536 R0
SYMATTR InstName CF12
SYMATTR Value 100n
SYMBOL polcap 272 1536 R0
SYMATTR InstName CF10
SYMATTR Value 220µ
SYMBOL cap -1600 -1472 R0
SYMATTR InstName CF33
SYMATTR Value 100n
SYMBOL polcap -1488 -1472 R0
SYMATTR InstName CF31
SYMATTR Value 220µ
SYMBOL cap -1600 1776 R0
SYMATTR InstName CF34
SYMATTR Value 100n
SYMBOL polcap -1488 1776 R0
SYMATTR InstName CF32
SYMATTR Value 220µ
SYMBOL polcap -1616 432 R0
SYMATTR InstName CAF
SYMATTR Value 2.2m
SYMBOL diode -1488 384 R0
SYMATTR InstName D33
SYMATTR Value D1N4148
SYMBOL diode -1488 480 R0
SYMATTR InstName D34
SYMATTR Value D1N4148
SYMBOL diode -1360 544 M180
WINDOW 0 24 64 Left 2
WINDOW 3 24 0 Left 2
SYMATTR InstName D32
SYMATTR Value D1N4148
SYMBOL diode -1360 448 M180
WINDOW 0 24 64 Left 2
WINDOW 3 24 0 Left 2
SYMATTR InstName D31
SYMATTR Value D1N4148
SYMBOL polcap -2576 112 R90
WINDOW 0 0 32 VBottom 2
WINDOW 3 32 32 VTop 2
SYMATTR InstName CAI
SYMATTR Value 47µ
SYMBOL cap -992 96 R0
SYMATTR InstName CC0
SYMATTR Value {CComp1}
SYMBOL voltage 1824 -1360 R0
SYMATTR InstName VPHV
SYMATTR Value {PHV}
SYMBOL voltage 1952 -1360 R0
SYMATTR InstName VPLV
SYMATTR Value {PLV}
SYMBOL voltage 2112 -1360 R0
SYMATTR InstName VNHV
SYMATTR Value {NHV}
SYMBOL voltage 2240 -1360 R0
SYMATTR InstName VNLV
SYMATTR Value {NLV}
SYMBOL voltage 2384 -1360 R0
SYMATTR InstName VPRHV
SYMATTR Value {PRHV}
SYMBOL voltage 2656 -1360 R0
SYMATTR InstName VNRHV
SYMATTR Value {NRHV}
SYMBOL voltage 2512 -1360 R0
SYMATTR InstName VPRLV
SYMATTR Value {PRLV}
SYMBOL voltage 2800 -1360 R0
SYMATTR InstName VNRLV
SYMATTR Value {NRLV}
SYMBOL voltage 2240 -1376 R180
WINDOW 123 0 0 Left 0
WINDOW 39 0 0 Left 0
WINDOW 0 -94 105 Left 2
WINDOW 3 -94 77 Invisible 2
SYMATTR InstName Vripple4
SYMATTR Value PULSE({ripple_amp_L} 0 0 10m 0 0 10m)
SYMBOL voltage 2112 -1376 R180
WINDOW 123 0 0 Left 0
WINDOW 39 0 0 Left 0
WINDOW 0 -93 106 Left 2
WINDOW 3 -93 78 Invisible 2
SYMATTR InstName Vripple3
SYMATTR Value PULSE({ripple_amp_H} 0 0 10m 0 0 10m)
SYMBOL voltage 1824 -1488 R0
WINDOW 123 0 0 Left 0
WINDOW 39 0 0 Left 0
WINDOW 0 1 4 Left 2
WINDOW 3 70 110 Invisible 2
SYMATTR InstName Vripple1
SYMATTR Value PULSE({ripple_amp_H} 0 0 10m 0 0 10m)
SYMBOL voltage 1952 -1488 R0
WINDOW 123 0 0 Left 0
WINDOW 39 0 0 Left 0
WINDOW 0 0 6 Left 2
WINDOW 3 0 34 Invisible 2
SYMATTR InstName Vripple2
SYMATTR Value PULSE({ripple_amp_L} 0 0 10m 0 0 10m)
SYMBOL zener -624 -752 R180
WINDOW 0 -53 70 Left 2
WINDOW 3 -131 -1 Left 2
SYMATTR InstName DZ3
SYMATTR Value DI_BZX84C22
SYMATTR Prefix X
SYMBOL zener -640 1040 R180
WINDOW 0 -51 32 Left 2
WINDOW 3 39 27 Left 2
SYMATTR InstName DZ4
SYMATTR Value DI_BZX84C22
SYMATTR Prefix X
SYMBOL zener -288 -512 R180
WINDOW 0 24 64 Left 2
WINDOW 3 -84 11 Left 2
SYMATTR InstName DZ1
SYMATTR Value D1N4371
SYMBOL zener -288 816 R180
WINDOW 0 24 64 Left 2
WINDOW 3 -84 11 Left 2
SYMATTR InstName DZ2
SYMATTR Value D1N4371
TEXT 2256 -968 Left 2 !.tran 0 6m 1m 0.0001m
TEXT 2264 -784 Left 2 !.param freq 10k
TEXT 2256 -936 Left 2 ;.op
TEXT 2136 -632 Left 2 !.fourier {freq} 30 -1 V(out)
TEXT 2656 -984 Left 2 !.lib 2SA1302.lib
TEXT 2656 -952 Left 2 !.lib 2SC3281.lib
TEXT 2656 -664 Left 2 !.lib MBR1645.lib
TEXT 2656 -920 Left 2 !.lib MJE340.lib
TEXT 2656 -888 Left 2 !.lib MJE350.lib
TEXT 2656 -696 Left 2 !.lib D1N4148.lib
TEXT 2656 -856 Left 2 !.lib MPSA42.lib
TEXT 2656 -824 Left 2 !.lib MPSA92.lib
TEXT 2256 -896 Left 2 ;.ac dec 10000 0.01 10G
TEXT 2264 -752 Left 2 !.param VPin={VPin50W}
TEXT 2656 -600 Left 2 !.lib BZX84C5V1.lib
TEXT 2656 -792 Left 2 !.lib MMBTA42.lib
TEXT 2656 -760 Left 2 !.lib MMBTA92.lib
TEXT 2656 -728 Left 2 !.lib MMPQ6700.lib
TEXT 2136 -600 Left 2 !.option plotwinsize=0
TEXT 2136 -504 Left 2 !.meas TRAN Vrms RMS V(out)
TEXT 2136 -472 Left 2 !.meas TRAN Pout PARAM (Vrms*Vrms/{RL})
TEXT 2136 -568 Left 2 !.option numdgt=9
TEXT 2136 -536 Left 2 !.meas TRAN Vout_max MAX V(out)
TEXT 2264 -720 Left 2 !.param RL=8
TEXT 2136 -392 Left 2 !.meas TRAN PinPHV AVG (V(+HV)*(-I(VPHV)) + V(+RHV)*(-I(VPRHV)))\n.meas TRAN PinPLV AVG (V(+LV)*(-I(VPLV)) + V(+RLV)*(-I(VPRLV)))\n.meas TRAN PinNHV AVG (V(-HV)*(-I(VNHV)) + V(-RHV)*(-I(VNRHV)))\n.meas TRAN PinNLV AVG (V(-LV)*(-I(VNLV)) + V(-RLV)*(-I(VNRLV)))\n.meas TRAN Pin param (PinPHV + PinPLV + PinNHV + PinNLV )\n.meas TRAN Eff param (Pout / Pin)
TEXT -1040 -416 Left 3 ;Multiplicador de VBE
TEXT -2168 128 Left 2 !.param r_deg=20.0
TEXT -2216 72 Left 3 ;Degeneración de emisor
TEXT 1920 -912 Left 2 !.param VPin1W=272.5m
TEXT 1920 -720 Left 2 !.param VPinMAX=2
TEXT 1920 -880 Left 2 !.param VPin5W=609.4m
TEXT 1920 -848 Left 2 !.param VPin10W=862m
TEXT 1920 -784 Left 2 !.param VPin45W=1.926
TEXT 1920 -752 Left 2 !.param VPin50W=1.928
TEXT -400 -1576 Left 2 !.param CComp1=6.8n
TEXT -400 -1536 Left 2 !.param CComp2N=27p
TEXT -400 -1456 Left 2 !.param CComp3=220p
TEXT -360 -1632 Left 2 ;Compensación
TEXT -400 -1496 Left 2 !.param CComp2P=27p
TEXT -400 -1416 Left 2 !.param CComp4=1.2p
TEXT 1864 -1976 Left 2 !.param PHV=+{HV} PLV=+{LV} NHV=-{HV}
TEXT 1728 -1144 Left 2 !.param HV=LINELEVEL*SQRT(2)*HTRAFOEFF - DIODESDROP
TEXT 1728 -1112 Left 2 !.param LV=LINELEVEL*SQRT(2)*LTRAFOEFF - DIODESDROP
TEXT 1272 -1352 Left 2 !.param RHV=40
TEXT 1272 -1376 Left 2 !.param RLV=15
TEXT 1272 -1328 Left 2 !.param ripple_amp_H=2
TEXT 1864 -2000 Left 2 !.param NLV=-{LV} PRHV={RHV} NRHV=-{RHV} PRLV={RLV} NRLV=-{RLV}
TEXT 1272 -1296 Left 2 !.param ripple_amp_L=1.1
TEXT 1272 -1528 Left 2 !.param HTRAFOEFF=40
TEXT 1272 -1496 Left 2 !.param LTRAFOEFF=12
TEXT 1272 -1464 Left 2 !.param LINELEVEL=1
TEXT 1240 -1672 Left 3 ;Tensión de línea(220V):\n180V a 240V => 0.818 a 1.091
TEXT 1272 -1432 Left 2 !.param DIODESDROP=1.5
TEXT 1272 -1592 Left 2 !.param MAXLINELEVEL=1.091
TEXT 1272 -1568 Left 2 !.param MINLINELEVEL=0.818
TEXT 1920 -816 Left 2 !.param VPin30W=1.4928
TEXT 2656 -632 Left 2 !.lib D1N4371.lib
TEXT 2656 -568 Left 2 !.lib BZX84C22.lib
TEXT -2144 1848 Left 3 ;Diferencia de corrientes
TEXT -2144 -1640 Left 3 ;Diferencia de corrientes
LINE Normal -768 1088 -768 880 2
LINE Normal -736 1072 -768 1088 2
LINE Normal -800 1072 -768 1088 2
LINE Normal -560 -864 -560 -1072 2
LINE Normal -560 -864 -560 -864 2
LINE Normal -560 -864 -560 -864 2
LINE Normal -576 -880 -560 -864 2
LINE Normal -576 -880 -576 -880 2
LINE Normal -544 -880 -560 -864 2
LINE Normal -704 -896 -704 -1040 2
LINE Normal -704 -896 -704 -896 2
LINE Normal -704 -896 -704 -896 2
LINE Normal -720 -912 -704 -896 2
LINE Normal -720 -912 -720 -912 2
LINE Normal -688 -912 -704 -896 2
LINE Normal -880 -1120 -880 -1264 2
LINE Normal -880 -1120 -880 -1120 2
LINE Normal -880 -1120 -880 -1120 2
LINE Normal -896 -1136 -880 -1120 2
LINE Normal -896 -1136 -896 -1136 2
LINE Normal -864 -1136 -880 -1120 2
LINE Normal -272 -720 -272 -720 2
LINE Normal -272 -720 -272 -720 2
LINE Normal -288 -736 -272 -720 2
LINE Normal -288 -736 -288 -736 2
LINE Normal -256 -736 -272 -720 2
LINE Normal -464 -176 -464 -384 2
LINE Normal -464 -176 -464 -176 2
LINE Normal -464 -176 -464 -176 2
LINE Normal -480 -192 -464 -176 2
LINE Normal -480 -192 -480 -192 2
LINE Normal -448 -192 -464 -176 2
LINE Normal -464 592 -464 384 2
LINE Normal -464 592 -464 592 2
LINE Normal -464 592 -464 592 2
LINE Normal -480 576 -464 592 2
LINE Normal -480 576 -480 576 2
LINE Normal -448 576 -464 592 2
LINE Normal -608 -496 -608 -640 2
LINE Normal -608 -496 -608 -496 2
LINE Normal -608 -496 -608 -496 2
LINE Normal -624 -512 -608 -496 2
LINE Normal -624 -512 -624 -512 2
LINE Normal -592 -512 -608 -496 2
LINE Normal -624 896 -624 752 2
LINE Normal -624 896 -624 896 2
LINE Normal -624 896 -624 896 2
LINE Normal -640 880 -624 896 2
LINE Normal -640 880 -640 880 2
LINE Normal -608 880 -624 896 2
LINE Normal -592 1296 -592 1152 2
LINE Normal -592 1296 -592 1296 2
LINE Normal -592 1296 -592 1296 2
LINE Normal -608 1280 -592 1296 2
LINE Normal -608 1280 -608 1280 2
LINE Normal -576 1280 -592 1296 2
LINE Normal -896 1392 -896 1248 2
LINE Normal -896 1392 -896 1392 2
LINE Normal -896 1392 -896 1392 2
LINE Normal -912 1376 -896 1392 2
LINE Normal -912 1376 -912 1376 2
LINE Normal -880 1376 -896 1392 2
LINE Normal -1792 -976 -1792 -1120 2
LINE Normal -1792 -976 -1792 -976 2
LINE Normal -1792 -976 -1792 -976 2
LINE Normal -1808 -992 -1792 -976 2
LINE Normal -1808 -992 -1808 -992 2
LINE Normal -1776 -992 -1792 -976 2
LINE Normal -2272 -960 -2272 -1104 2
LINE Normal -2272 -960 -2272 -960 2
LINE Normal -2272 -960 -2272 -960 2
LINE Normal -2288 -976 -2272 -960 2
LINE Normal -2288 -976 -2288 -976 2
LINE Normal -2256 -976 -2272 -960 2
LINE Normal -2176 -400 -2176 -544 2
LINE Normal -2176 -400 -2176 -400 2
LINE Normal -2176 -400 -2176 -400 2
LINE Normal -2192 -416 -2176 -400 2
LINE Normal -2192 -416 -2192 -416 2
LINE Normal -2160 -416 -2176 -400 2
LINE Normal -2176 720 -2176 576 2
LINE Normal -2176 720 -2176 720 2
LINE Normal -2176 720 -2176 720 2
LINE Normal -2192 704 -2176 720 2
LINE Normal -2192 704 -2192 704 2
LINE Normal -2160 704 -2176 720 2
LINE Normal -1936 -528 -1936 -672 2
LINE Normal -1936 -528 -1936 -528 2
LINE Normal -1936 -528 -1936 -528 2
LINE Normal -1952 -544 -1936 -528 2
LINE Normal -1952 -544 -1952 -544 2
LINE Normal -1920 -544 -1936 -528 2
LINE Normal -1936 880 -1936 736 2
LINE Normal -1936 880 -1936 880 2
LINE Normal -1936 880 -1936 880 2
LINE Normal -1952 864 -1936 880 2
LINE Normal -1952 864 -1952 864 2
LINE Normal -1920 864 -1936 880 2
LINE Normal -1808 1552 -1808 1408 2
LINE Normal -1808 1552 -1808 1552 2
LINE Normal -1808 1552 -1808 1552 2
LINE Normal -1824 1536 -1808 1552 2
LINE Normal -1824 1536 -1824 1536 2
LINE Normal -1792 1536 -1808 1552 2
LINE Normal -2224 1536 -2224 1392 2
LINE Normal -2224 1536 -2224 1536 2
LINE Normal -2224 1536 -2224 1536 2
LINE Normal -2240 1520 -2224 1536 2
LINE Normal -2240 1520 -2240 1520 2
LINE Normal -2208 1520 -2224 1536 2
LINE Normal -272 -720 -272 -864 2
LINE Normal -272 1120 -272 1120 2
LINE Normal -272 1120 -272 1120 2
LINE Normal -288 1104 -272 1120 2
LINE Normal -288 1104 -288 1104 2
LINE Normal -256 1104 -272 1120 2
LINE Normal -272 1120 -272 976 2
LINE Normal 608 1088 608 1088 2
LINE Normal 608 1088 608 1088 2
LINE Normal 1776 -1696 1776 -1840 2
LINE Normal 1776 -1696 1776 -1696 2
LINE Normal 1776 -1696 1776 -1696 2
LINE Normal 1760 -1712 1776 -1696 2
LINE Normal 1760 -1712 1760 -1712 2
LINE Normal 1792 -1712 1776 -1696 2
LINE Normal 2416 -1696 2416 -1840 2
LINE Normal 2416 -1696 2416 -1696 2
LINE Normal 2416 -1696 2416 -1696 2
LINE Normal 2400 -1712 2416 -1696 2
LINE Normal 2400 -1712 2400 -1712 2
LINE Normal 2432 -1712 2416 -1696 2
LINE Normal 1920 -1696 1920 -1840 2
LINE Normal 1920 -1696 1920 -1696 2
LINE Normal 1920 -1696 1920 -1696 2
LINE Normal 1904 -1712 1920 -1696 2
LINE Normal 1904 -1712 1904 -1712 2
LINE Normal 1936 -1712 1920 -1696 2
LINE Normal 2064 -1696 2064 -1840 2
LINE Normal 2064 -1696 2064 -1696 2
LINE Normal 2064 -1696 2064 -1696 2
LINE Normal 2048 -1712 2064 -1696 2
LINE Normal 2048 -1712 2048 -1712 2
LINE Normal 2080 -1712 2064 -1696 2
LINE Normal 2832 -1696 2832 -1840 2
LINE Normal 2832 -1696 2832 -1696 2
LINE Normal 2832 -1696 2832 -1696 2
LINE Normal 2816 -1712 2832 -1696 2
LINE Normal 2816 -1712 2816 -1712 2
LINE Normal 2848 -1712 2832 -1696 2
LINE Normal 2688 -1696 2688 -1840 2
LINE Normal 2688 -1696 2688 -1696 2
LINE Normal 2688 -1696 2688 -1696 2
LINE Normal 2672 -1712 2688 -1696 2
LINE Normal 2672 -1712 2672 -1712 2
LINE Normal 2704 -1712 2688 -1696 2
LINE Normal 2544 -1696 2544 -1840 2
LINE Normal 2544 -1696 2544 -1696 2
LINE Normal 2544 -1696 2544 -1696 2
LINE Normal 2528 -1712 2544 -1696 2
LINE Normal 2528 -1712 2528 -1712 2
LINE Normal 2560 -1712 2544 -1696 2
LINE Normal 2272 -1696 2272 -1840 2
LINE Normal 2272 -1696 2272 -1696 2
LINE Normal 2272 -1696 2272 -1696 2
LINE Normal 2256 -1712 2272 -1696 2
LINE Normal 2256 -1712 2256 -1712 2
LINE Normal 2288 -1712 2272 -1696 2
LINE Normal -2176 -256 -2176 -256 2
LINE Normal -2176 -256 -2176 -256 2
LINE Normal -2256 -544 -2256 -544 2
LINE Normal -2256 -544 -2256 -544 2
LINE Normal -2256 -480 -2256 -480 2
LINE Normal -2256 -480 -2256 -480 2
LINE Normal -2176 512 -2176 512 2
LINE Normal -2176 512 -2176 512 2
LINE Normal -2256 288 -2256 288 2
LINE Normal -2256 288 -2256 288 2
LINE Normal -2176 496 -2176 496 2
LINE Normal -2176 496 -2176 496 2
LINE Normal -208 848 -208 848 2
LINE Normal -208 848 -208 848 2
LINE Normal -224 832 -208 848 2
LINE Normal -224 832 -224 832 2
LINE Normal -192 832 -208 848 2
LINE Normal -208 848 -208 704 2
LINE Normal -224 -480 -224 -480 2
LINE Normal -224 -480 -224 -480 2
LINE Normal -240 -496 -224 -480 2
LINE Normal -240 -496 -240 -496 2
LINE Normal -208 -496 -224 -480 2
LINE Normal -224 -480 -224 -624 2
LINE Normal -864 64 -864 -80 2
LINE Normal -864 64 -864 64 2
LINE Normal -864 64 -864 64 2
LINE Normal -880 48 -864 64 2
LINE Normal -880 48 -880 48 2
LINE Normal -848 48 -864 64 2
LINE Normal -864 -192 -864 -336 2
LINE Normal -864 -192 -864 -192 2
LINE Normal -864 -192 -864 -192 2
LINE Normal -880 -208 -864 -192 2
LINE Normal -880 -208 -880 -208 2
LINE Normal -848 -208 -864 -192 2
LINE Normal -864 608 -864 464 2
LINE Normal -864 608 -864 608 2
LINE Normal -864 608 -864 608 2
LINE Normal -880 592 -864 608 2
LINE Normal -880 592 -880 592 2
LINE Normal -848 592 -864 608 2
RECTANGLE Normal 2608 -848 2240 -1008
RECTANGLE Normal 2608 -672 2240 -816 3
RECTANGLE Normal 2960 -432 2624 -1008 2
RECTANGLE Normal 2608 -432 2128 -656 3
RECTANGLE Normal 2128 -224 2960 -416 3
RECTANGLE Normal -400 656 -1040 -400 3
RECTANGLE Normal -1936 160 -2192 96 2
RECTANGLE Normal 2224 -672 1904 -928 3
RECTANGLE Normal -112 -1376 -432 -1616 1
RECTANGLE Normal 2960 -1056 1712 -2048 4
RECTANGLE Normal 1664 -1216 1216 -1696 2
ARC Normal -608 -272 -464 464 -563 453 -565 -267 2
ARC Normal -304 -624 -384 -448 -344 -632 -348 -442 2
ARC Normal -544 -896 -464 -720 -500 -714 -504 -904 2
ARC Normal -592 944 -512 1120 -548 1126 -552 936 2
ARC Normal -304 704 -384 880 -344 696 -348 886 2
ARC Normal -1744 -1360 -1648 -1200 -1650 -1202 -1671 -1357 2
ARC Normal -2288 -1344 -2384 -1184 -2361 -1341 -2382 -1186 2
ARC Normal -2208 -976 -2112 -816 -2114 -818 -2135 -973 2
ARC Normal -1824 -976 -1920 -816 -1897 -973 -1918 -818 2
ARC Normal -1952 -528 -1856 -368 -1858 -370 -1879 -525 2
ARC Normal -1936 576 -1840 736 -1842 734 -1863 579 2
ARC Normal -2032 -1248 -2128 -1088 -2105 -1245 -2126 -1090 2
ARC Normal -2160 -256 -2256 -96 -2233 -253 -2254 -98 2
ARC Normal -2160 -448 -2256 -288 -2233 -445 -2254 -290 2
ARC Normal -2160 320 -2256 480 -2233 323 -2254 478 2
ARC Normal -2160 496 -2256 656 -2233 499 -2254 654 2
ARC Normal -1744 1472 -1648 1632 -1650 1630 -1671 1475 2
ARC Normal -2304 1616 -2400 1456 -2398 1458 -2377 1613 2
ARC Normal -1984 1488 -2080 1328 -2078 1330 -2057 1485 2
ARC Normal -2192 1056 -2096 1216 -2098 1214 -2119 1059 2
ARC Normal -1856 1056 -1952 1216 -1929 1059 -1950 1214 2
ARC Normal -592 1184 -496 1344 -498 1342 -519 1187 2
ARC Normal -912 1328 -992 1504 -952 1320 -956 1510 2
ARC Normal -288 1072 -192 1232 -194 1230 -215 1075 2
ARC Normal -592 752 -512 928 -548 934 -552 744 2
ARC Normal -864 -1200 -944 -1024 -904 -1208 -908 -1018 2
ARC Normal -576 -1104 -480 -944 -482 -946 -503 -1101 2
ARC Normal -592 -720 -496 -560 -498 -562 -519 -717 2
ARC Normal -304 -1008 -208 -848 -210 -850 -231 -1005 2

The netlist it stands for:
* amplifier_V0.6_SMD_Test.asc
Q20 VBEM2 N010 feedback 0 MJE350
Q19 VBEM1 N009 feedback 0 MJE340
R21 VBEM1 N009 499
R22 N010 VBEM2 499
Q13 CQ13 CQ15 EQ13 0 MMBTA92
Q14 CQ14 CQ16 EQ14 0 MMBTA42
Q18 0 NEG_DIFF_OUT EQ18 0 MMBTA42
RFB2 N007 N011 2.61k
RFB1 feedback N007 35.7k
RIOF1 N006 0 35.7k
Q17 0 POS_DIFF_OUT EQ17 0 MMBTA92
Q41 POS_DIFF_OUT N006 EQ41 0 MMPQ6700-NPN
Q33 CQ31 N007 EQ33 0 MMPQ6700-NPN
Q42 NEG_DIFF_OUT N006 EQ42 0 MMPQ6700-PNP
Q34 CQ32 N007 EQ34 0 MMPQ6700-PNP
CC3 CQ13 POS_DIFF_OUT {CComp3}
CC4 CQ14 NEG_DIFF_OUT {CComp3}
Q31 CQ31 EQ37 EQ31 0 MMPQ6700-PNP
Q39 POS_DIFF_OUT EQ37 EQ39 0 MMPQ6700-PNP
Q40 NEG_DIFF_OUT EQ38 EQ40 0 MMPQ6700-NPN
Q32 CQ32 EQ38 EQ32 0 MMPQ6700-NPN
R17 +RHV EQ13 220
R18 EQ14 -RHV 220
R39 +RLV EQ39 500
R31 +RLV EQ31 500
R32 -RLV EQ32 500
R40 -RLV EQ40 500
Q38 +RLV CQ32 EQ38 0 MMBTA42
Q37 -RLV CQ31 EQ37 0 MMBTA92
R38 EQ38 -RLV 50k
R37 +RLV EQ37 50k
R43 0 AD35 1.8k
Q35 CQ35 AD35 EQ35 0 MMBTA42
R35 EQ35 -RLV 1.0k
Q36 CQ36 BQ36 EQ36 0 MMBTA92
R36 +RLV EQ36 1.02k
R44 BQ36 0 1.8k
RL feedback 0 22k
VG in 0 SINE(0 {VPin} {freq}) AC 1
XDZ31 -RLV CD35 DI_BZX84C5V1  ; pins + -
XDZ32 BQ36 CD36 DI_BZX84C5V1  ; pins + -
XRV32 EQ32 EQ40 -RLV Rtot=10k wiper=0.54371
XRV31 EQ39 EQ31 +RLV Rtot=10k wiper=0.44834
CC5 feedback N007 {CComp4}
Q15 CQ15 BQ15 EQ15 0 MMBTA92
R19 +RHV EQ15 210
R23 BQ15 0 7.5k
R20 -RHV EQ16 210
R24 BQ16 0 7.5k
Q16 CQ16 BQ16 EQ16 0 MMBTA42
D12 BQ16 N015 D1N4148
D10 N015 -RHV D1N4148
D9 +RHV N005 D1N4148
D11 N005 BQ15 D1N4148
D7 CQ15 N008 D1N4148
D8 N014 CQ16 D1N4148
XRVMV N010 N009 N010 Rtot=2k wiper=0.6646
D36 +RLV CD36 D1N4148
D35 AD35 CD35 D1N4148
R41 CQ35 EQ41 {r_deg}
R33 EQ33 CQ35 {r_deg}
R42 CQ36 EQ42 {r_deg}
R34 EQ34 CQ36 {r_deg}
CF11 +RHV 0 100n
CF9 +RHV 0 220µ
CF12 -RHV 0 100n
CF10 -RHV 0 220µ
CF33 +RLV 0 100n
CF31 +RLV 0 220µ
CF34 -RLV 0 100n
CF32 -RLV 0 220µ
CAF N011 0 2.2m
D33 N011 N012 D1N4148
D34 N012 0 D1N4148
D32 0 N013 D1N4148
D31 N013 N011 D1N4148
CAI N006 in 47µ
CC0 VBEM1 VBEM2 {CComp1}
VPHV N001 0 {PHV}
VPLV N002 0 {PLV}
VNHV N003 0 {NHV}
VNLV N004 0 {NLV}
VPRHV +RHV 0 {PRHV}
VNRHV -RHV 0 {NRHV}
VPRLV +RLV 0 {PRLV}
VNRLV -RLV 0 {NRLV}
Vripple4 N004 -LV PULSE({ripple_amp_L} 0 0 10m 0 0 10m)
Vripple3 N003 -HV PULSE({ripple_amp_H} 0 0 10m 0 0 10m)
Vripple1 +HV N001 PULSE({ripple_amp_H} 0 0 10m 0 0 10m)
Vripple2 +LV N002 PULSE({ripple_amp_L} 0 0 10m 0 0 10m)
XDZ3 EQ17 N008 DI_BZX84C22  ; pins + -
XDZ4 N014 EQ18 DI_BZX84C22  ; pins + -
DZ1 VBEM1 CQ13 D1N4371
DZ2 CQ14 VBEM2 D1N4371
.model D D
.lib standard.dio
.model NPN NPN
.model PNP PNP
.lib standard.bjt
.tran 0 6m 1m 0.0001m
.param freq 10k
* .op
.fourier {freq} 30 -1 V(out)
.lib 2SA1302.lib
.lib 2SC3281.lib
.lib MBR1645.lib
.lib MJE340.lib
.lib MJE350.lib
.lib D1N4148.lib
.lib MPSA42.lib
.lib MPSA92.lib
* .ac dec 10000 0.01 10G
.param VPin={VPin50W}
.lib BZX84C5V1.lib
.lib MMBTA42.lib
.lib MMBTA92.lib
.lib MMPQ6700.lib
.option plotwinsize=0
.meas TRAN Vrms RMS V(out)
.meas TRAN Pout PARAM (Vrms*Vrms/{RL})
.option numdgt=9
.meas TRAN Vout_max MAX V(out)
.param RL=8
.meas TRAN PinPHV AVG (V(+HV)*(-I(VPHV)) + V(+RHV)*(-I(VPRHV)))
.meas TRAN PinPLV AVG (V(+LV)*(-I(VPLV)) + V(+RLV)*(-I(VPRLV)))
.meas TRAN PinNHV AVG (V(-HV)*(-I(VNHV)) + V(-RHV)*(-I(VNRHV)))
.meas TRAN PinNLV AVG (V(-LV)*(-I(VNLV)) + V(-RLV)*(-I(VNRLV)))
.meas TRAN Pin param (PinPHV + PinPLV + PinNHV + PinNLV )
.meas TRAN Eff param (Pout / Pin)
* Multiplicador de VBE
.param r_deg=20.0
* Degeneración de emisor
.param VPin1W=272.5m
.param VPinMAX=2
.param VPin5W=609.4m
.param VPin10W=862m
.param VPin45W=1.926
.param VPin50W=1.928
.param CComp1=6.8n
.param CComp2N=27p
.param CComp3=220p
* Compensación
.param CComp2P=27p
.param CComp4=1.2p
.param PHV=+{HV} PLV=+{LV} NHV=-{HV}
.param HV=LINELEVEL*SQRT(2)*HTRAFOEFF - DIODESDROP
.param LV=LINELEVEL*SQRT(2)*LTRAFOEFF - DIODESDROP
.param RHV=40
.param RLV=15
.param ripple_amp_H=2
.param NLV=-{LV} PRHV={RHV} NRHV=-{RHV} PRLV={RLV} NRLV=-{RLV}
.param ripple_amp_L=1.1
.param HTRAFOEFF=40
.param LTRAFOEFF=12
.param LINELEVEL=1
* Tensión de línea(220V):
* 180V a 240V => 0.818 a 1.091
.param DIODESDROP=1.5
.param MAXLINELEVEL=1.091
.param MINLINELEVEL=0.818
.param VPin30W=1.4928
.lib D1N4371.lib
.lib BZX84C22.lib
* Diferencia de corrientes
* Diferencia de corrientes
.backanno
.end